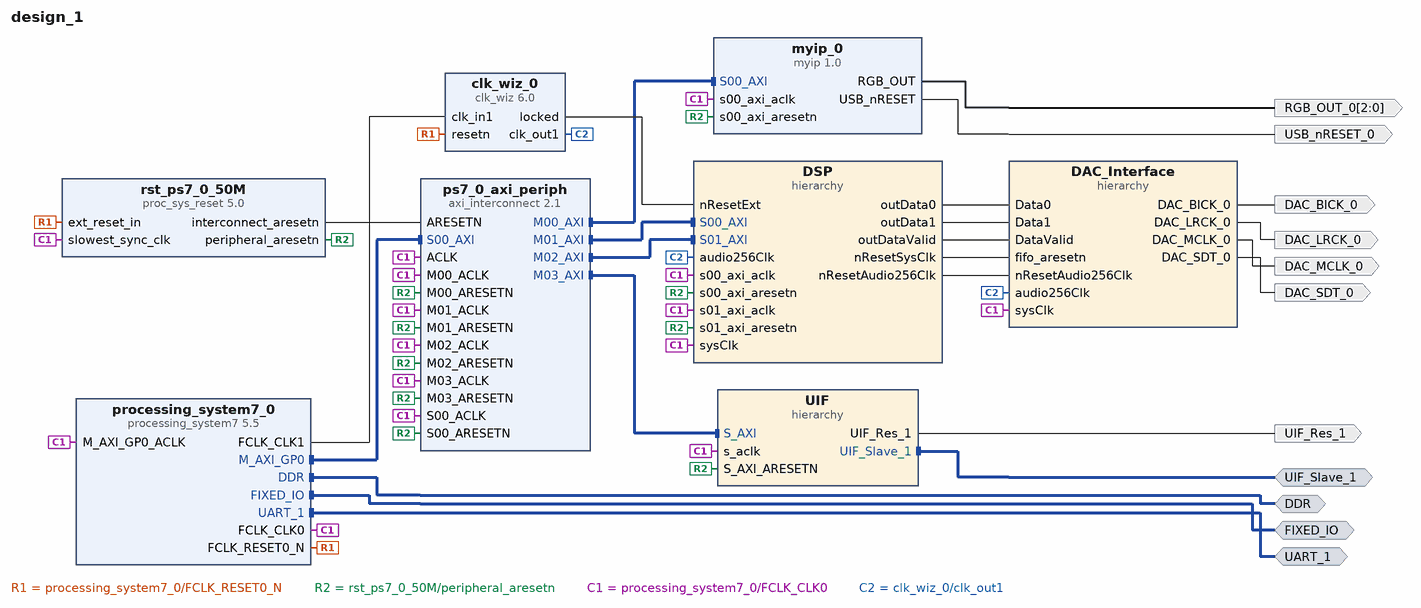
[diagram p0: block diagram of the top level]
# Vivado block design design_1, xc7z020clg484-1, Vivado 2018.2
create_bd_design design_1

create_bd_intf_port -mode Master -vlnv xilinx.com:interface:ddrx_rtl:1.0 DDR
create_bd_intf_port -mode Master -vlnv xilinx.com:display_processing_system7:fixedio_rtl:1.0 FIXED_IO
create_bd_intf_port -mode Master -vlnv xilinx.com:interface:uart_rtl:1.0 UART_1
create_bd_intf_port -mode Master -vlnv tamapochi1:user:UIF_Slave_rtl:1.0 UIF_Slave_1
create_bd_port -dir O -from 2 -to 0 RGB_OUT_0
create_bd_port -dir O USB_nRESET_0
create_bd_port -dir O DAC_BICK_0
create_bd_port -dir O DAC_MCLK_0
create_bd_port -dir O DAC_SDT_0
create_bd_port -dir O DAC_LRCK_0
create_bd_port -dir O UIF_Res_1

create_bd_cell -type ip -vlnv xilinx.com:ip:processing_system7:5.5 processing_system7_0
set_property -dict [list \
  CONFIG.PCW_FCLK_CLK1_BUF TRUE \
  CONFIG.PCW_SDIO_PERIPHERAL_FREQMHZ 50 \
  CONFIG.PCW_UART_PERIPHERAL_FREQMHZ 100 \
  CONFIG.PCW_I2C_PERIPHERAL_FREQMHZ 111.111115 \
  CONFIG.PCW_FPGA0_PERIPHERAL_FREQMHZ 100 \
  CONFIG.PCW_FPGA1_PERIPHERAL_FREQMHZ 100 \
  CONFIG.PCW_EN_CLK1_PORT 1 \
  CONFIG.PCW_PRESET_BANK1_VOLTAGE {LVCMOS 1.8V} \
  CONFIG.PCW_UIPARAM_DDR_MEMORY_TYPE {DDR 3 (Low Voltage)} \
  CONFIG.PCW_UIPARAM_DDR_BUS_WIDTH {16 Bit} \
  CONFIG.PCW_UIPARAM_DDR_PARTNO Custom \
  CONFIG.PCW_SD0_PERIPHERAL_ENABLE 1 \
  CONFIG.PCW_SD0_SD0_IO {MIO 40 .. 45} \
  CONFIG.PCW_SD0_GRP_CD_ENABLE 1 \
  CONFIG.PCW_SD0_GRP_CD_IO {MIO 47} \
  CONFIG.PCW_SD0_GRP_WP_ENABLE 0 \
  CONFIG.PCW_UART1_PERIPHERAL_ENABLE 1 \
  CONFIG.PCW_UART1_UART1_IO EMIO \
  CONFIG.PCW_USB0_PERIPHERAL_ENABLE 0 \
  CONFIG.PCW_USB_RESET_ENABLE 0 \
  CONFIG.PCW_I2C0_PERIPHERAL_ENABLE 1 \
  CONFIG.PCW_I2C0_I2C0_IO {MIO 10 .. 11} \
  CONFIG.PCW_I2C0_GRP_INT_ENABLE 0 \
  CONFIG.PCW_I2C_RESET_ENABLE 0 \
  CONFIG.PCW_GPIO_MIO_GPIO_ENABLE 1 \
  CONFIG.PCW_GPIO_MIO_GPIO_IO MIO \
  CONFIG.PCW_FPGA_FCLK1_ENABLE 1 \
] [get_bd_cells processing_system7_0]
# 247 more settings of processing_system7_0 are not shown: defaults, MIO pin electricals, DDR timing, and values the tool derives
create_bd_cell -type ip -vlnv xilinx.com:ip:axi_interconnect:2.1 ps7_0_axi_periph
set_property -dict {CONFIG.NUM_MI 4} [get_bd_cells ps7_0_axi_periph]
create_bd_cell -type ip -vlnv xilinx.com:ip:proc_sys_reset:5.0 rst_ps7_0_50M
create_bd_cell -type ip -vlnv xilinx.com:user:myip:1.0 myip_0
create_bd_cell -type ip -vlnv xilinx.com:ip:clk_wiz:6.0 clk_wiz_0
set_property -dict [list \
  CONFIG.JITTER_SEL No_Jitter \
  CONFIG.PRIM_IN_FREQ 100 \
  CONFIG.CLKIN1_JITTER_PS 100.0 \
  CONFIG.CLKOUT1_REQUESTED_OUT_FREQ 12.288 \
  CONFIG.PRIM_SOURCE No_buffer \
  CONFIG.CLKOUT1_DRIVES BUFGCE \
  CONFIG.CLKOUT2_DRIVES BUFGCE \
  CONFIG.CLKOUT3_DRIVES BUFGCE \
  CONFIG.CLKOUT4_DRIVES BUFGCE \
  CONFIG.CLKOUT5_DRIVES BUFGCE \
  CONFIG.CLKOUT6_DRIVES BUFGCE \
  CONFIG.CLKOUT7_DRIVES BUFGCE \
  CONFIG.FEEDBACK_SOURCE FDBK_AUTO \
  CONFIG.USE_LOCKED true \
  CONFIG.USE_RESET true \
  CONFIG.USE_INCLK_STOPPED false \
  CONFIG.RESET_PORT resetn \
  CONFIG.MMCM_DIVCLK_DIVIDE 5 \
  CONFIG.MMCM_BANDWIDTH OPTIMIZED \
  CONFIG.MMCM_CLKFBOUT_MULT_F 48.000 \
  CONFIG.MMCM_CLKIN1_PERIOD 10.000 \
  CONFIG.MMCM_CLKIN2_PERIOD 10.000 \
  CONFIG.MMCM_CLKOUT0_DIVIDE_F 78.125 \
  CONFIG.RESET_TYPE ACTIVE_LOW \
  CONFIG.USE_SAFE_CLOCK_STARTUP true \
  CONFIG.CLKOUT1_JITTER 360.948 \
  CONFIG.CLKOUT1_PHASE_ERROR 301.601 \
] [get_bd_cells clk_wiz_0]
create_bd_cell -type hier DSP
create_bd_cell -type hier DAC_Interface
create_bd_cell -type hier UIF

# ---- hierarchy /DSP ----
current_bd_instance /DSP
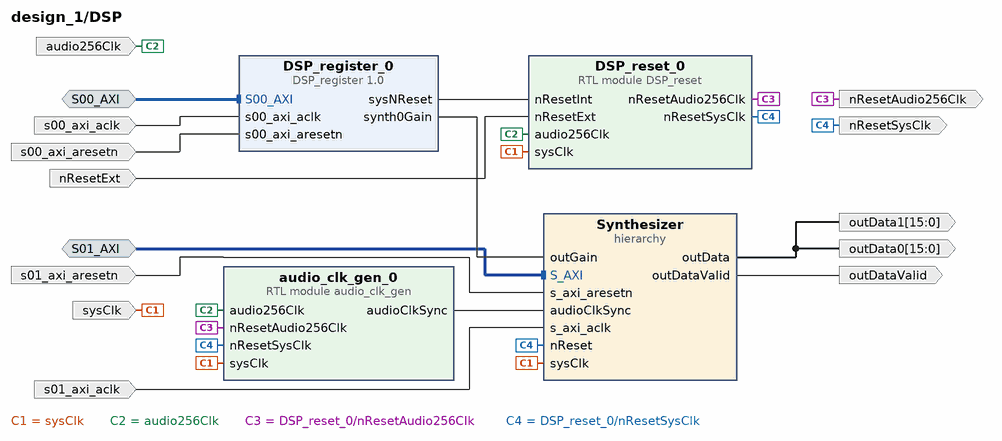
[diagram p1: block diagram inside /DSP]
create_bd_intf_pin -mode Slave -vlnv xilinx.com:interface:aximm_rtl:1.0 S00_AXI
create_bd_intf_pin -mode Slave -vlnv xilinx.com:interface:aximm_rtl:1.0 S01_AXI
create_bd_pin -dir O -from 15 -to 0 outData0
create_bd_pin -dir I sysClk
create_bd_pin -dir I -type clk s00_axi_aclk
create_bd_pin -dir I -type rst s00_axi_aresetn
create_bd_pin -dir I -type rst s01_axi_aresetn
create_bd_pin -dir I -type clk s01_axi_aclk
create_bd_pin -dir O -from 15 -to 0 outData1
create_bd_pin -dir I audio256Clk
create_bd_pin -dir I nResetExt
create_bd_pin -dir O outDataValid
create_bd_pin -dir O nResetSysClk
create_bd_pin -dir O nResetAudio256Clk

create_bd_cell -type hier Synthesizer
create_bd_cell -type ip -vlnv xilinx.com:user:DSP_register:1.0 DSP_register_0
create_bd_cell -type module -reference DSP_reset DSP_reset_0
create_bd_cell -type module -reference audio_clk_gen audio_clk_gen_0

# ---- hierarchy /DSP/Synthesizer ----
current_bd_instance /DSP/Synthesizer
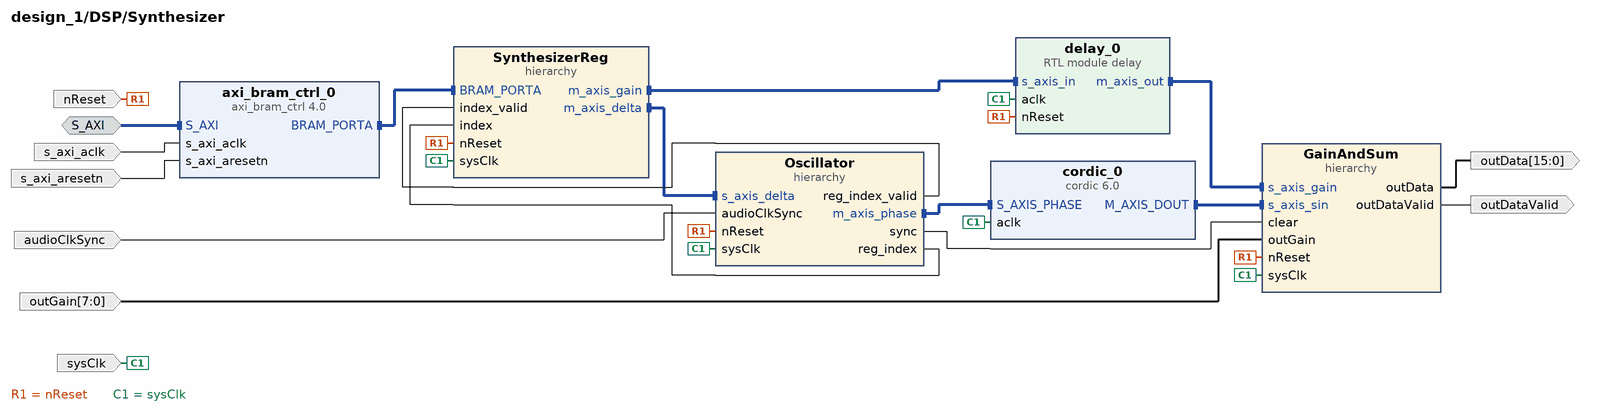
[diagram p2: block diagram inside /DSP/Synthesizer]
create_bd_intf_pin -mode Slave -vlnv xilinx.com:interface:aximm_rtl:1.0 S_AXI
create_bd_pin -dir I -type clk s_axi_aclk
create_bd_pin -dir I -type rst s_axi_aresetn
create_bd_pin -dir I -type clk sysClk
create_bd_pin -dir O -from 15 -to 0 outData
create_bd_pin -dir I audioClkSync
create_bd_pin -dir I nReset
create_bd_pin -dir I -from 7 -to 0 outGain
create_bd_pin -dir O outDataValid

create_bd_cell -type ip -vlnv xilinx.com:ip:axi_bram_ctrl:4.0 axi_bram_ctrl_0
set_property -dict {CONFIG.DATA_WIDTH 32 CONFIG.PROTOCOL AXI4 CONFIG.SINGLE_PORT_BRAM 1} [get_bd_cells axi_bram_ctrl_0]
create_bd_cell -type ip -vlnv xilinx.com:ip:cordic:6.0 cordic_0
set_property -dict [list \
  CONFIG.Functional_Selection Sin_and_Cos \
  CONFIG.Pipelining_Mode Optimal \
  CONFIG.Data_Format SignedFraction \
  CONFIG.Phase_Format Scaled_Radians \
  CONFIG.Coarse_Rotation true \
  CONFIG.Compensation_Scaling No_Scale_Compensation \
] [get_bd_cells cordic_0]
create_bd_cell -type module -reference delay delay_0
set_property -dict {CONFIG.WIDTH 14 CONFIG.DELAY 25} [get_bd_cells delay_0]
create_bd_cell -type hier SynthesizerReg
create_bd_cell -type hier Oscillator
create_bd_cell -type hier GainAndSum

# ---- hierarchy /DSP/Synthesizer/SynthesizerReg ----
current_bd_instance /DSP/Synthesizer/SynthesizerReg
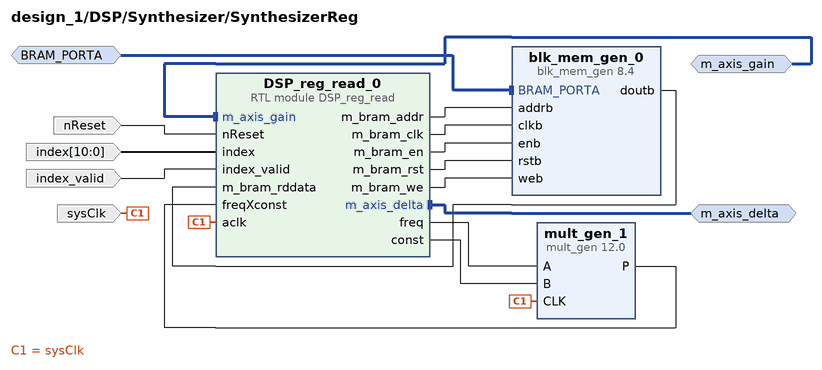
[diagram p3: block diagram inside /DSP/Synthesizer/SynthesizerReg]
create_bd_intf_pin -mode Master -vlnv xilinx.com:interface:axis_rtl:1.0 m_axis_delta
create_bd_intf_pin -mode Master -vlnv xilinx.com:interface:axis_rtl:1.0 m_axis_gain
create_bd_intf_pin -mode Slave -vlnv xilinx.com:interface:bram_rtl:1.0 BRAM_PORTA
create_bd_pin -dir I -type clk sysClk
create_bd_pin -dir I nReset
create_bd_pin -dir I -from 10 -to 0 index
create_bd_pin -dir I index_valid

create_bd_cell -type ip -vlnv xilinx.com:ip:mult_gen:12.0 mult_gen_1
set_property -dict [list \
  CONFIG.MultType Parallel_Multiplier \
  CONFIG.PortAType Unsigned \
  CONFIG.PortBType Unsigned \
  CONFIG.Multiplier_Construction Use_Mults \
  CONFIG.OptGoal Speed \
  CONFIG.PipeStages 4 \
] [get_bd_cells mult_gen_1]
create_bd_cell -type ip -vlnv xilinx.com:ip:blk_mem_gen:8.4 blk_mem_gen_0
set_property -dict [list \
  CONFIG.Memory_Type True_Dual_Port_RAM \
  CONFIG.Enable_32bit_Address true \
  CONFIG.Assume_Synchronous_Clk false \
  CONFIG.Operating_Mode_A WRITE_FIRST \
  CONFIG.Read_Width_B 32 \
  CONFIG.Operating_Mode_B WRITE_FIRST \
  CONFIG.Enable_B Use_ENB_Pin \
  CONFIG.Register_PortA_Output_of_Memory_Primitives false \
  CONFIG.Register_PortB_Output_of_Memory_Primitives false \
  CONFIG.Use_RSTA_Pin true \
  CONFIG.Use_RSTB_Pin true \
  CONFIG.Port_A_Write_Rate 50 \
  CONFIG.Port_B_Clock 100 \
  CONFIG.Port_B_Write_Rate 50 \
  CONFIG.Port_B_Enable_Rate 100 \
  CONFIG.use_bram_block BRAM_Controller \
  CONFIG.EN_SAFETY_CKT true \
] [get_bd_cells blk_mem_gen_0]
create_bd_cell -type module -reference DSP_reg_read DSP_reg_read_0

# ---- hierarchy /DSP/Synthesizer/Oscillator ----
current_bd_instance /DSP/Synthesizer/Oscillator
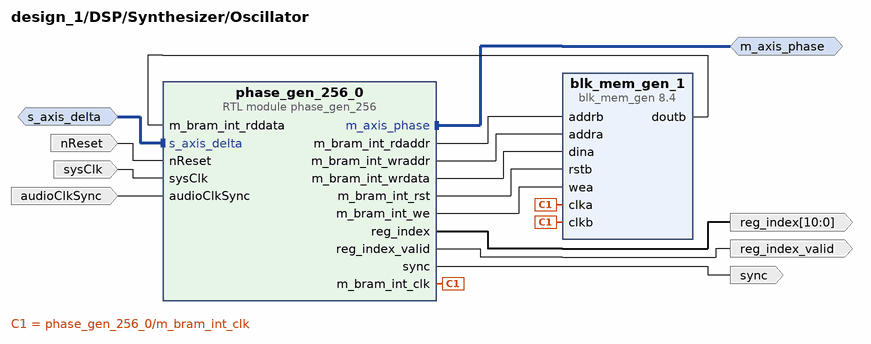
[diagram p4: block diagram inside /DSP/Synthesizer/Oscillator]
create_bd_intf_pin -mode Master -vlnv xilinx.com:interface:axis_rtl:1.0 m_axis_phase
create_bd_intf_pin -mode Slave -vlnv xilinx.com:interface:axis_rtl:1.0 s_axis_delta
create_bd_pin -dir I nReset
create_bd_pin -dir I sysClk
create_bd_pin -dir I audioClkSync
create_bd_pin -dir O -from 10 -to 0 reg_index
create_bd_pin -dir O reg_index_valid
create_bd_pin -dir O sync

create_bd_cell -type ip -vlnv xilinx.com:ip:blk_mem_gen:8.4 blk_mem_gen_1
set_property -dict [list \
  CONFIG.Memory_Type Simple_Dual_Port_RAM \
  CONFIG.Enable_32bit_Address false \
  CONFIG.Use_Byte_Write_Enable false \
  CONFIG.Assume_Synchronous_Clk true \
  CONFIG.Write_Width_A 24 \
  CONFIG.Write_Depth_A 2048 \
  CONFIG.Operating_Mode_A NO_CHANGE \
  CONFIG.Enable_A Always_Enabled \
  CONFIG.Write_Width_B 24 \
  CONFIG.Read_Width_B 24 \
  CONFIG.Enable_B Always_Enabled \
  CONFIG.Register_PortB_Output_of_Memory_Primitives false \
  CONFIG.Use_RSTB_Pin true \
  CONFIG.Reset_Priority_B SR \
  CONFIG.Port_B_Clock 100 \
  CONFIG.Port_B_Enable_Rate 100 \
  CONFIG.use_bram_block Stand_Alone \
  CONFIG.EN_SAFETY_CKT true \
] [get_bd_cells blk_mem_gen_1]
create_bd_cell -type module -reference phase_gen_256 phase_gen_256_0

# ---- hierarchy /DSP/Synthesizer/GainAndSum ----
current_bd_instance /DSP/Synthesizer/GainAndSum
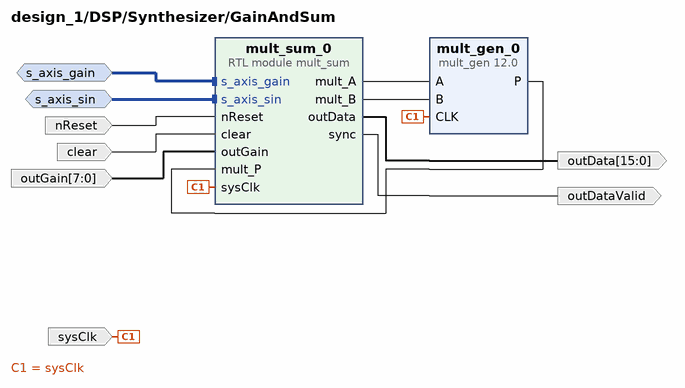
[diagram p5: block diagram inside /DSP/Synthesizer/GainAndSum]
create_bd_intf_pin -mode Slave -vlnv xilinx.com:interface:axis_rtl:1.0 s_axis_gain
create_bd_intf_pin -mode Slave -vlnv xilinx.com:interface:axis_rtl:1.0 s_axis_sin
create_bd_pin -dir I nReset
create_bd_pin -dir I -type clk sysClk
create_bd_pin -dir I clear
create_bd_pin -dir O -from 15 -to 0 outData
create_bd_pin -dir I -from 7 -to 0 outGain
create_bd_pin -dir O outDataValid

create_bd_cell -type ip -vlnv xilinx.com:ip:mult_gen:12.0 mult_gen_0
set_property -dict [list \
  CONFIG.PortAWidth 16 \
  CONFIG.PortBType Unsigned \
  CONFIG.PortBWidth 14 \
  CONFIG.Multiplier_Construction Use_Mults \
  CONFIG.PipeStages 3 \
] [get_bd_cells mult_gen_0]
create_bd_cell -type module -reference mult_sum mult_sum_0
set_property -dict {CONFIG.CLEAR_DELAY 29} [get_bd_cells mult_sum_0]

# ---- hierarchy /DAC_Interface ----
current_bd_instance /DAC_Interface
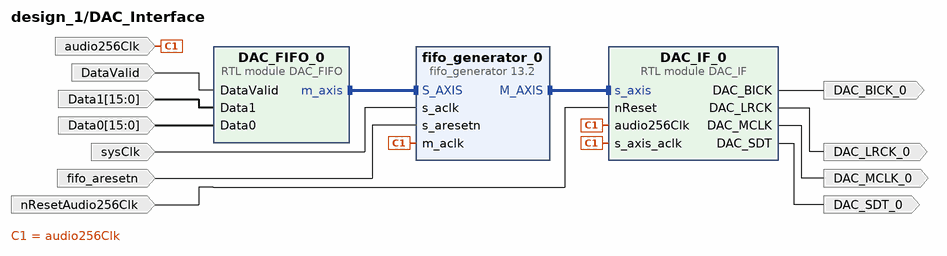
[diagram p6: block diagram inside /DAC_Interface]
create_bd_pin -dir I -from 15 -to 0 Data0
create_bd_pin -dir I -from 15 -to 0 Data1
create_bd_pin -dir I DataValid
create_bd_pin -dir I -type clk audio256Clk
create_bd_pin -dir I sysClk
create_bd_pin -dir I -type rst fifo_aresetn
create_bd_pin -dir I nResetAudio256Clk
create_bd_pin -dir O DAC_MCLK_0
create_bd_pin -dir O DAC_BICK_0
create_bd_pin -dir O DAC_LRCK_0
create_bd_pin -dir O DAC_SDT_0

create_bd_cell -type ip -vlnv xilinx.com:ip:fifo_generator:13.2 fifo_generator_0
set_property -dict [list \
  CONFIG.INTERFACE_TYPE AXI_STREAM \
  CONFIG.Full_Flags_Reset_Value 1 \
  CONFIG.Clock_Type_AXI Independent_Clock \
  CONFIG.TDATA_NUM_BYTES 4 \
  CONFIG.TUSER_WIDTH 0 \
  CONFIG.FIFO_Implementation_wach Independent_Clocks_Distributed_RAM \
  CONFIG.FIFO_Implementation_wdch Independent_Clocks_Block_RAM \
  CONFIG.FIFO_Implementation_wrch Independent_Clocks_Distributed_RAM \
  CONFIG.FIFO_Implementation_rach Independent_Clocks_Distributed_RAM \
  CONFIG.FIFO_Implementation_rdch Independent_Clocks_Block_RAM \
  CONFIG.FIFO_Implementation_axis Independent_Clocks_Block_RAM \
  CONFIG.Input_Depth_axis 16 \
  CONFIG.Use_Embedded_Registers_axis false \
  CONFIG.Enable_Safety_Circuit true \
] [get_bd_cells fifo_generator_0]
create_bd_cell -type module -reference DAC_FIFO DAC_FIFO_0
create_bd_cell -type module -reference DAC_IF DAC_IF_0

# ---- hierarchy /UIF ----
current_bd_instance /UIF
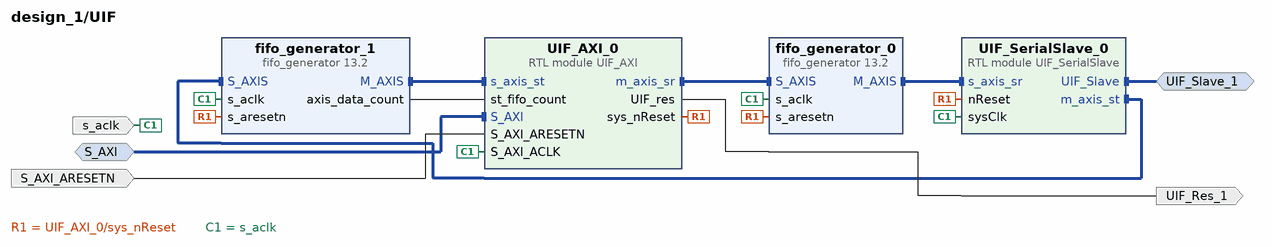
[diagram p7: block diagram inside /UIF]
create_bd_intf_pin -mode Slave -vlnv xilinx.com:interface:aximm_rtl:1.0 S_AXI
create_bd_intf_pin -mode Master -vlnv tamapochi1:user:UIF_Slave_rtl:1.0 UIF_Slave_1
create_bd_pin -dir I -type clk s_aclk
create_bd_pin -dir I -type rst S_AXI_ARESETN
create_bd_pin -dir O UIF_Res_1

create_bd_cell -type ip -vlnv xilinx.com:ip:fifo_generator:13.2 fifo_generator_0
set_property -dict [list \
  CONFIG.INTERFACE_TYPE AXI_STREAM \
  CONFIG.Full_Flags_Reset_Value 1 \
  CONFIG.Clock_Type_AXI Common_Clock \
  CONFIG.TUSER_WIDTH 0 \
  CONFIG.Enable_TLAST false \
  CONFIG.HAS_TSTRB false \
  CONFIG.HAS_TKEEP false \
  CONFIG.FIFO_Implementation_wach Common_Clock_Distributed_RAM \
  CONFIG.FIFO_Implementation_wdch Common_Clock_Block_RAM \
  CONFIG.FIFO_Implementation_wrch Common_Clock_Distributed_RAM \
  CONFIG.FIFO_Implementation_rach Common_Clock_Distributed_RAM \
  CONFIG.FIFO_Implementation_rdch Common_Clock_Block_RAM \
  CONFIG.FIFO_Implementation_axis Common_Clock_Block_RAM \
  CONFIG.Input_Depth_axis 2048 \
  CONFIG.Enable_Data_Counts_axis true \
  CONFIG.Enable_Safety_Circuit true \
] [get_bd_cells fifo_generator_0]
create_bd_cell -type ip -vlnv xilinx.com:ip:fifo_generator:13.2 fifo_generator_1
set_property -dict [list \
  CONFIG.INTERFACE_TYPE AXI_STREAM \
  CONFIG.Full_Flags_Reset_Value 1 \
  CONFIG.Clock_Type_AXI Common_Clock \
  CONFIG.TUSER_WIDTH 0 \
  CONFIG.Enable_TLAST false \
  CONFIG.HAS_TSTRB false \
  CONFIG.HAS_TKEEP false \
  CONFIG.FIFO_Implementation_wach Common_Clock_Distributed_RAM \
  CONFIG.FIFO_Implementation_wdch Common_Clock_Block_RAM \
  CONFIG.FIFO_Implementation_wrch Common_Clock_Distributed_RAM \
  CONFIG.FIFO_Implementation_rach Common_Clock_Distributed_RAM \
  CONFIG.FIFO_Implementation_rdch Common_Clock_Block_RAM \
  CONFIG.FIFO_Implementation_axis Common_Clock_Block_RAM \
  CONFIG.Input_Depth_axis 2048 \
  CONFIG.Enable_Data_Counts_axis true \
  CONFIG.Enable_Safety_Circuit true \
] [get_bd_cells fifo_generator_1]
create_bd_cell -type module -reference UIF_SerialSlave UIF_SerialSlave_0
create_bd_cell -type module -reference UIF_AXI UIF_AXI_0

# ---- connections ----

current_bd_instance /DSP
connect_bd_intf_net [get_bd_intf_pins S00_AXI] [get_bd_intf_pins DSP_register_0/S00_AXI]
connect_bd_intf_net [get_bd_intf_pins S01_AXI] [get_bd_intf_pins Synthesizer/S_AXI]
connect_bd_net -net sysClk_0_1 [get_bd_pins sysClk] \
  [get_bd_pins DSP_reset_0/sysClk] [get_bd_pins audio_clk_gen_0/sysClk] [get_bd_pins Synthesizer/sysClk]
connect_bd_net -net s00_axi_aclk_0_1 [get_bd_pins s00_axi_aclk] [get_bd_pins DSP_register_0/s00_axi_aclk]
connect_bd_net -net s00_axi_aresetn_0_1 [get_bd_pins s00_axi_aresetn] [get_bd_pins DSP_register_0/s00_axi_aresetn]
connect_bd_net -net audio_clk_gen_0_audioClk [get_bd_pins audio_clk_gen_0/audioClkSync] [get_bd_pins Synthesizer/audioClkSync]
connect_bd_net -net s_axi_aresetn_0_1 [get_bd_pins s01_axi_aresetn] [get_bd_pins Synthesizer/s_axi_aresetn]
connect_bd_net -net s_axi_aclk_0_1 [get_bd_pins s01_axi_aclk] [get_bd_pins Synthesizer/s_axi_aclk]
connect_bd_net -net mult_sum_0_out [get_bd_pins Synthesizer/outData] [get_bd_pins outData0] [get_bd_pins outData1]
connect_bd_net -net audioClk256_0_1 [get_bd_pins audio256Clk] [get_bd_pins DSP_reset_0/audio256Clk] [get_bd_pins audio_clk_gen_0/audio256Clk]
connect_bd_net [get_bd_pins DSP_register_0/sysNReset] [get_bd_pins DSP_reset_0/nResetInt]
connect_bd_net -net nResetExt_0_1 [get_bd_pins nResetExt] [get_bd_pins DSP_reset_0/nResetExt]
connect_bd_net [get_bd_pins DSP_register_0/synth0Gain] [get_bd_pins Synthesizer/outGain]
connect_bd_net -net Synthesizer_sync_0 [get_bd_pins Synthesizer/outDataValid] [get_bd_pins outDataValid]
connect_bd_net -net DSP_reset_0_nResetAudioClk [get_bd_pins DSP_reset_0/nResetAudio256Clk] \
  [get_bd_pins nResetAudio256Clk] [get_bd_pins audio_clk_gen_0/nResetAudio256Clk]
connect_bd_net [get_bd_pins DSP_reset_0/nResetSysClk] \
  [get_bd_pins nResetSysClk] [get_bd_pins audio_clk_gen_0/nResetSysClk] [get_bd_pins Synthesizer/nReset]

current_bd_instance /DSP/Synthesizer
connect_bd_intf_net [get_bd_intf_pins SynthesizerReg/BRAM_PORTA] [get_bd_intf_pins axi_bram_ctrl_0/BRAM_PORTA]
connect_bd_intf_net [get_bd_intf_pins delay_0/m_axis_out] [get_bd_intf_pins GainAndSum/s_axis_gain]
connect_bd_intf_net [get_bd_intf_pins GainAndSum/s_axis_sin] [get_bd_intf_pins cordic_0/M_AXIS_DOUT]
connect_bd_intf_net -intf_net phase_gen_256_0_m_axis_phase [get_bd_intf_pins Oscillator/m_axis_phase] [get_bd_intf_pins cordic_0/S_AXIS_PHASE]
connect_bd_intf_net -intf_net DSP_reg_read_0_m_axis_delta [get_bd_intf_pins SynthesizerReg/m_axis_delta] [get_bd_intf_pins Oscillator/s_axis_delta]
connect_bd_intf_net -intf_net DSP_reg_read_0_m_axis_gain [get_bd_intf_pins SynthesizerReg/m_axis_gain] [get_bd_intf_pins delay_0/s_axis_in]
connect_bd_intf_net [get_bd_intf_pins S_AXI] [get_bd_intf_pins axi_bram_ctrl_0/S_AXI]
connect_bd_net -net phase_gen_256_0_sync [get_bd_pins Oscillator/sync] [get_bd_pins GainAndSum/clear]
connect_bd_net -net s_axi_aclk_0_1 [get_bd_pins s_axi_aclk] [get_bd_pins axi_bram_ctrl_0/s_axi_aclk]
connect_bd_net -net s_axi_aresetn_0_1 [get_bd_pins s_axi_aresetn] [get_bd_pins axi_bram_ctrl_0/s_axi_aresetn]
connect_bd_net -net DSP_register_0_sysNReset [get_bd_pins nReset] \
  [get_bd_pins delay_0/nReset] [get_bd_pins SynthesizerReg/nReset] [get_bd_pins Oscillator/nReset] \
  [get_bd_pins GainAndSum/nReset]
connect_bd_net -net sysClk_0_1 [get_bd_pins sysClk] \
  [get_bd_pins cordic_0/aclk] [get_bd_pins delay_0/aclk] [get_bd_pins SynthesizerReg/sysClk] [get_bd_pins Oscillator/sysClk] \
  [get_bd_pins GainAndSum/sysClk]
connect_bd_net -net mult_sum_0_out [get_bd_pins GainAndSum/outData] [get_bd_pins outData]
connect_bd_net -net audio_clk_gen_0_audioClk [get_bd_pins audioClkSync] [get_bd_pins Oscillator/audioClkSync]
connect_bd_net -net outGain_0_1 [get_bd_pins outGain] [get_bd_pins GainAndSum/outGain]
connect_bd_net -net phase_gen_256_0_reg_index_valid [get_bd_pins Oscillator/reg_index_valid] [get_bd_pins SynthesizerReg/index_valid]
connect_bd_net -net phase_gen_256_0_reg_index [get_bd_pins Oscillator/reg_index] [get_bd_pins SynthesizerReg/index]
connect_bd_net -net GainAndSum_sync_0 [get_bd_pins GainAndSum/outDataValid] [get_bd_pins outDataValid]

current_bd_instance /DSP/Synthesizer/SynthesizerReg
connect_bd_intf_net [get_bd_intf_pins m_axis_delta] [get_bd_intf_pins DSP_reg_read_0/m_axis_delta]
connect_bd_intf_net [get_bd_intf_pins m_axis_gain] [get_bd_intf_pins DSP_reg_read_0/m_axis_gain]
connect_bd_intf_net -intf_net axi_bram_ctrl_0_BRAM_PORTA [get_bd_intf_pins BRAM_PORTA] [get_bd_intf_pins blk_mem_gen_0/BRAM_PORTA]
connect_bd_net [get_bd_pins DSP_reg_read_0/freq] [get_bd_pins mult_gen_1/A]
connect_bd_net [get_bd_pins DSP_reg_read_0/const] [get_bd_pins mult_gen_1/B]
connect_bd_net [get_bd_pins mult_gen_1/P] [get_bd_pins DSP_reg_read_0/freqXconst]
connect_bd_net -net phase_gen_256_0_s_bram_addr [get_bd_pins DSP_reg_read_0/m_bram_addr] [get_bd_pins blk_mem_gen_0/addrb]
connect_bd_net -net phase_gen_256_0_s_bram_clk [get_bd_pins DSP_reg_read_0/m_bram_clk] [get_bd_pins blk_mem_gen_0/clkb]
connect_bd_net [get_bd_pins blk_mem_gen_0/doutb] [get_bd_pins DSP_reg_read_0/m_bram_rddata]
connect_bd_net -net phase_gen_256_0_bram_en [get_bd_pins DSP_reg_read_0/m_bram_en] [get_bd_pins blk_mem_gen_0/enb]
connect_bd_net -net phase_gen_256_0_bram_rst [get_bd_pins DSP_reg_read_0/m_bram_rst] [get_bd_pins blk_mem_gen_0/rstb]
connect_bd_net -net phase_gen_256_0_m_bram_we [get_bd_pins DSP_reg_read_0/m_bram_we] [get_bd_pins blk_mem_gen_0/web]
connect_bd_net -net sysClk_0_1 [get_bd_pins sysClk] [get_bd_pins mult_gen_1/CLK] [get_bd_pins DSP_reg_read_0/aclk]
connect_bd_net -net DSP_register_0_sysNReset [get_bd_pins nReset] [get_bd_pins DSP_reg_read_0/nReset]
connect_bd_net -net phase_gen_256_0_reg_index [get_bd_pins index] [get_bd_pins DSP_reg_read_0/index]
connect_bd_net -net phase_gen_256_0_reg_index_valid [get_bd_pins index_valid] [get_bd_pins DSP_reg_read_0/index_valid]

current_bd_instance /DSP/Synthesizer/Oscillator
connect_bd_intf_net [get_bd_intf_pins m_axis_phase] [get_bd_intf_pins phase_gen_256_0/m_axis_phase]
connect_bd_intf_net -intf_net DSP_reg_read_0_m_axis_delta [get_bd_intf_pins s_axis_delta] [get_bd_intf_pins phase_gen_256_0/s_axis_delta]
connect_bd_net [get_bd_pins phase_gen_256_0/m_bram_int_rdaddr] [get_bd_pins blk_mem_gen_1/addrb]
connect_bd_net [get_bd_pins phase_gen_256_0/m_bram_int_wraddr] [get_bd_pins blk_mem_gen_1/addra]
connect_bd_net [get_bd_pins phase_gen_256_0/m_bram_int_clk] [get_bd_pins blk_mem_gen_1/clka] [get_bd_pins blk_mem_gen_1/clkb]
connect_bd_net -net blk_mem_gen_1_douta [get_bd_pins blk_mem_gen_1/doutb] [get_bd_pins phase_gen_256_0/m_bram_int_rddata]
connect_bd_net [get_bd_pins phase_gen_256_0/m_bram_int_wrdata] [get_bd_pins blk_mem_gen_1/dina]
connect_bd_net [get_bd_pins phase_gen_256_0/m_bram_int_rst] [get_bd_pins blk_mem_gen_1/rstb]
connect_bd_net [get_bd_pins phase_gen_256_0/m_bram_int_we] [get_bd_pins blk_mem_gen_1/wea]
connect_bd_net -net DSP_register_0_sysNReset [get_bd_pins nReset] [get_bd_pins phase_gen_256_0/nReset]
connect_bd_net -net sysClk_0_1 [get_bd_pins sysClk] [get_bd_pins phase_gen_256_0/sysClk]
connect_bd_net -net audio_clk_gen_0_audioClk [get_bd_pins audioClkSync] [get_bd_pins phase_gen_256_0/audioClkSync]
connect_bd_net [get_bd_pins phase_gen_256_0/reg_index] [get_bd_pins reg_index]
connect_bd_net [get_bd_pins phase_gen_256_0/reg_index_valid] [get_bd_pins reg_index_valid]
connect_bd_net [get_bd_pins phase_gen_256_0/sync] [get_bd_pins sync]

current_bd_instance /DSP/Synthesizer/GainAndSum
connect_bd_intf_net -intf_net delay_0_m_axis_out [get_bd_intf_pins s_axis_gain] [get_bd_intf_pins mult_sum_0/s_axis_gain]
connect_bd_intf_net -intf_net cordic_0_M_AXIS_DOUT [get_bd_intf_pins s_axis_sin] [get_bd_intf_pins mult_sum_0/s_axis_sin]
connect_bd_net [get_bd_pins mult_sum_0/mult_A] [get_bd_pins mult_gen_0/A]
connect_bd_net [get_bd_pins mult_sum_0/mult_B] [get_bd_pins mult_gen_0/B]
connect_bd_net [get_bd_pins mult_gen_0/P] [get_bd_pins mult_sum_0/mult_P]
connect_bd_net -net DSP_register_0_sysNReset [get_bd_pins nReset] [get_bd_pins mult_sum_0/nReset]
connect_bd_net -net sysClk_0_1 [get_bd_pins sysClk] [get_bd_pins mult_gen_0/CLK] [get_bd_pins mult_sum_0/sysClk]
connect_bd_net -net phase_gen_256_0_sync [get_bd_pins clear] [get_bd_pins mult_sum_0/clear]
connect_bd_net -net mult_sum_0_out [get_bd_pins mult_sum_0/outData] [get_bd_pins outData]
connect_bd_net -net outGain_0_1 [get_bd_pins outGain] [get_bd_pins mult_sum_0/outGain]
connect_bd_net [get_bd_pins mult_sum_0/sync] [get_bd_pins outDataValid]

current_bd_instance /DAC_Interface
connect_bd_intf_net [get_bd_intf_pins fifo_generator_0/S_AXIS] [get_bd_intf_pins DAC_FIFO_0/m_axis]
connect_bd_intf_net [get_bd_intf_pins fifo_generator_0/M_AXIS] [get_bd_intf_pins DAC_IF_0/s_axis]
connect_bd_net -net DSP_outDataValid1 [get_bd_pins DataValid] [get_bd_pins DAC_FIFO_0/DataValid]
connect_bd_net -net clk_wiz_0_clk_out1 [get_bd_pins audio256Clk] \
  [get_bd_pins fifo_generator_0/m_aclk] [get_bd_pins DAC_IF_0/s_axis_aclk] [get_bd_pins DAC_IF_0/audio256Clk]
connect_bd_net -net processing_system7_0_FCLK_CLK0 [get_bd_pins sysClk] [get_bd_pins fifo_generator_0/s_aclk]
connect_bd_net -net DSP_nResetSysClk [get_bd_pins fifo_aresetn] [get_bd_pins fifo_generator_0/s_aresetn]
connect_bd_net -net DSP_outDataValid [get_bd_pins nResetAudio256Clk] [get_bd_pins DAC_IF_0/nReset]
connect_bd_net [get_bd_pins DAC_IF_0/DAC_MCLK] [get_bd_pins DAC_MCLK_0]
connect_bd_net -net DAC_IF_0_DAC_BCLK [get_bd_pins DAC_IF_0/DAC_BICK] [get_bd_pins DAC_BICK_0]
connect_bd_net [get_bd_pins DAC_IF_0/DAC_LRCK] [get_bd_pins DAC_LRCK_0]
connect_bd_net [get_bd_pins DAC_IF_0/DAC_SDT] [get_bd_pins DAC_SDT_0]
connect_bd_net -net DSP_outData2 [get_bd_pins Data1] [get_bd_pins DAC_FIFO_0/Data1]
connect_bd_net -net Data0_1 [get_bd_pins Data0] [get_bd_pins DAC_FIFO_0/Data0]

current_bd_instance /UIF
connect_bd_intf_net [get_bd_intf_pins UIF_AXI_0/m_axis_sr] [get_bd_intf_pins fifo_generator_0/S_AXIS]
connect_bd_intf_net [get_bd_intf_pins fifo_generator_1/M_AXIS] [get_bd_intf_pins UIF_AXI_0/s_axis_st]
connect_bd_intf_net [get_bd_intf_pins UIF_SerialSlave_0/s_axis_sr] [get_bd_intf_pins fifo_generator_0/M_AXIS]
connect_bd_intf_net [get_bd_intf_pins UIF_SerialSlave_0/m_axis_st] [get_bd_intf_pins fifo_generator_1/S_AXIS]
connect_bd_intf_net [get_bd_intf_pins S_AXI] [get_bd_intf_pins UIF_AXI_0/S_AXI]
connect_bd_intf_net [get_bd_intf_pins UIF_Slave_1] [get_bd_intf_pins UIF_SerialSlave_0/UIF_Slave]
connect_bd_net [get_bd_pins fifo_generator_1/axis_data_count] [get_bd_pins UIF_AXI_0/st_fifo_count]
connect_bd_net [get_bd_pins UIF_AXI_0/sys_nReset] \
  [get_bd_pins fifo_generator_0/s_aresetn] [get_bd_pins fifo_generator_1/s_aresetn] [get_bd_pins UIF_SerialSlave_0/nReset]
connect_bd_net -net processing_system7_0_FCLK_CLK0 [get_bd_pins s_aclk] \
  [get_bd_pins fifo_generator_0/s_aclk] [get_bd_pins fifo_generator_1/s_aclk] [get_bd_pins UIF_SerialSlave_0/sysClk] \
  [get_bd_pins UIF_AXI_0/S_AXI_ACLK]
connect_bd_net -net rst_ps7_0_50M_peripheral_aresetn [get_bd_pins S_AXI_ARESETN] [get_bd_pins UIF_AXI_0/S_AXI_ARESETN]
connect_bd_net [get_bd_pins UIF_AXI_0/UIF_res] [get_bd_pins UIF_Res_1]

current_bd_instance /
connect_bd_intf_net [get_bd_intf_pins processing_system7_0/M_AXI_GP0] [get_bd_intf_pins ps7_0_axi_periph/S00_AXI]
connect_bd_intf_net [get_bd_intf_pins ps7_0_axi_periph/M00_AXI] [get_bd_intf_pins myip_0/S00_AXI]
connect_bd_intf_net -intf_net S00_AXI_0_1 [get_bd_intf_pins DSP/S00_AXI] [get_bd_intf_pins ps7_0_axi_periph/M01_AXI]
connect_bd_intf_net [get_bd_intf_pins ps7_0_axi_periph/M02_AXI] [get_bd_intf_pins DSP/S01_AXI]
connect_bd_intf_net [get_bd_intf_pins ps7_0_axi_periph/M03_AXI] [get_bd_intf_pins UIF/S_AXI]
connect_bd_intf_net [get_bd_intf_ports DDR] [get_bd_intf_pins processing_system7_0/DDR]
connect_bd_intf_net [get_bd_intf_ports FIXED_IO] [get_bd_intf_pins processing_system7_0/FIXED_IO]
connect_bd_intf_net [get_bd_intf_ports UART_1] [get_bd_intf_pins processing_system7_0/UART_1]
connect_bd_intf_net -intf_net UIF_SerialSlave_0_UIF_Slave [get_bd_intf_ports UIF_Slave_1] [get_bd_intf_pins UIF/UIF_Slave_1]
connect_bd_net [get_bd_pins processing_system7_0/FCLK_RESET0_N] [get_bd_pins rst_ps7_0_50M/ext_reset_in] [get_bd_pins clk_wiz_0/resetn]
connect_bd_net [get_bd_pins rst_ps7_0_50M/peripheral_aresetn] \
  [get_bd_pins myip_0/s00_axi_aresetn] [get_bd_pins ps7_0_axi_periph/S00_ARESETN] [get_bd_pins ps7_0_axi_periph/M00_ARESETN] \
  [get_bd_pins ps7_0_axi_periph/M01_ARESETN] [get_bd_pins DSP/s00_axi_aresetn] [get_bd_pins ps7_0_axi_periph/M02_ARESETN] \
  [get_bd_pins DSP/s01_axi_aresetn] [get_bd_pins ps7_0_axi_periph/M03_ARESETN] [get_bd_pins UIF/S_AXI_ARESETN]
connect_bd_net [get_bd_pins rst_ps7_0_50M/interconnect_aresetn] [get_bd_pins ps7_0_axi_periph/ARESETN]
connect_bd_net [get_bd_pins myip_0/RGB_OUT] [get_bd_ports RGB_OUT_0]
connect_bd_net [get_bd_pins myip_0/USB_nRESET] [get_bd_ports USB_nRESET_0]
connect_bd_net -net DAC_IF_0_DAC_BCLK [get_bd_pins DAC_Interface/DAC_BICK_0] [get_bd_ports DAC_BICK_0]
connect_bd_net -net DAC_IF_0_DAC_MCLK [get_bd_pins DAC_Interface/DAC_MCLK_0] [get_bd_ports DAC_MCLK_0]
connect_bd_net -net DAC_IF_0_DAC_SDT [get_bd_pins DAC_Interface/DAC_SDT_0] [get_bd_ports DAC_SDT_0]
connect_bd_net -net DAC_IF_0_DAC_LRCK [get_bd_pins DAC_Interface/DAC_LRCK_0] [get_bd_ports DAC_LRCK_0]
connect_bd_net [get_bd_pins processing_system7_0/FCLK_CLK0] \
  [get_bd_pins rst_ps7_0_50M/slowest_sync_clk] [get_bd_pins processing_system7_0/M_AXI_GP0_ACLK] \
  [get_bd_pins myip_0/s00_axi_aclk] [get_bd_pins ps7_0_axi_periph/ACLK] [get_bd_pins ps7_0_axi_periph/S00_ACLK] \
  [get_bd_pins ps7_0_axi_periph/M00_ACLK] [get_bd_pins ps7_0_axi_periph/M01_ACLK] [get_bd_pins ps7_0_axi_periph/M02_ACLK] \
  [get_bd_pins DSP/sysClk] [get_bd_pins DSP/s00_axi_aclk] [get_bd_pins DSP/s01_axi_aclk] [get_bd_pins DAC_Interface/sysClk] \
  [get_bd_pins ps7_0_axi_periph/M03_ACLK] [get_bd_pins UIF/s_aclk]
connect_bd_net [get_bd_pins processing_system7_0/FCLK_CLK1] [get_bd_pins clk_wiz_0/clk_in1]
connect_bd_net [get_bd_pins clk_wiz_0/locked] [get_bd_pins DSP/nResetExt]
connect_bd_net [get_bd_pins clk_wiz_0/clk_out1] [get_bd_pins DSP/audio256Clk] [get_bd_pins DAC_Interface/audio256Clk]
connect_bd_net [get_bd_pins DSP/outData0] [get_bd_pins DAC_Interface/Data0]
connect_bd_net [get_bd_pins DSP/outData1] [get_bd_pins DAC_Interface/Data1]
connect_bd_net [get_bd_pins DSP/outDataValid] [get_bd_pins DAC_Interface/DataValid]
connect_bd_net [get_bd_pins DSP/nResetSysClk] [get_bd_pins DAC_Interface/fifo_aresetn]
connect_bd_net -net DSP_outDataValid [get_bd_pins DSP/nResetAudio256Clk] [get_bd_pins DAC_Interface/nResetAudio256Clk]
connect_bd_net -net UIF_AXI_0_UIF_res [get_bd_pins UIF/UIF_Res_1] [get_bd_ports UIF_Res_1]

# ---- address map ----
assign_bd_address -offset 0x40000000 -range 8K -target_address_space [get_bd_addr_spaces processing_system7_0/Data] [get_bd_addr_segs DSP/Synthesizer/axi_bram_ctrl_0/S_AXI/Mem0]
assign_bd_address -offset 0x43C00000 -range 64K -target_address_space [get_bd_addr_spaces processing_system7_0/Data] [get_bd_addr_segs myip_0/S00_AXI/S00_AXI_reg]
assign_bd_address -offset 0x43C10000 -range 64K -target_address_space [get_bd_addr_spaces processing_system7_0/Data] [get_bd_addr_segs DSP/DSP_register_0/S00_AXI/S00_AXI_reg]
assign_bd_address -offset 0x43C20000 -range 64K -target_address_space [get_bd_addr_spaces processing_system7_0/Data] [get_bd_addr_segs UIF/UIF_AXI_0/S_AXI/reg0]

validate_bd_design
save_bd_design
